# Altium schematic sheet cb_v0.SchDoc
size A4; PageSetup: Record=PageOptions|CenterHorizontal=True|CenterVertical=True|PrintScale=0.98|XCorrection=1.00|YCorrection=1.00|PrintKind=1|BorderSize=5000000|LeftOffset=0|BottomOffset=0|Orientation=2|PaperLength=1000|PaperWidth=1000|Scale=100|PaperSource=7|PrintQuality=600|MediaType=1|DitherType=10|PrintScaleMode=1|PaperKind=A4|PaperIndex=9
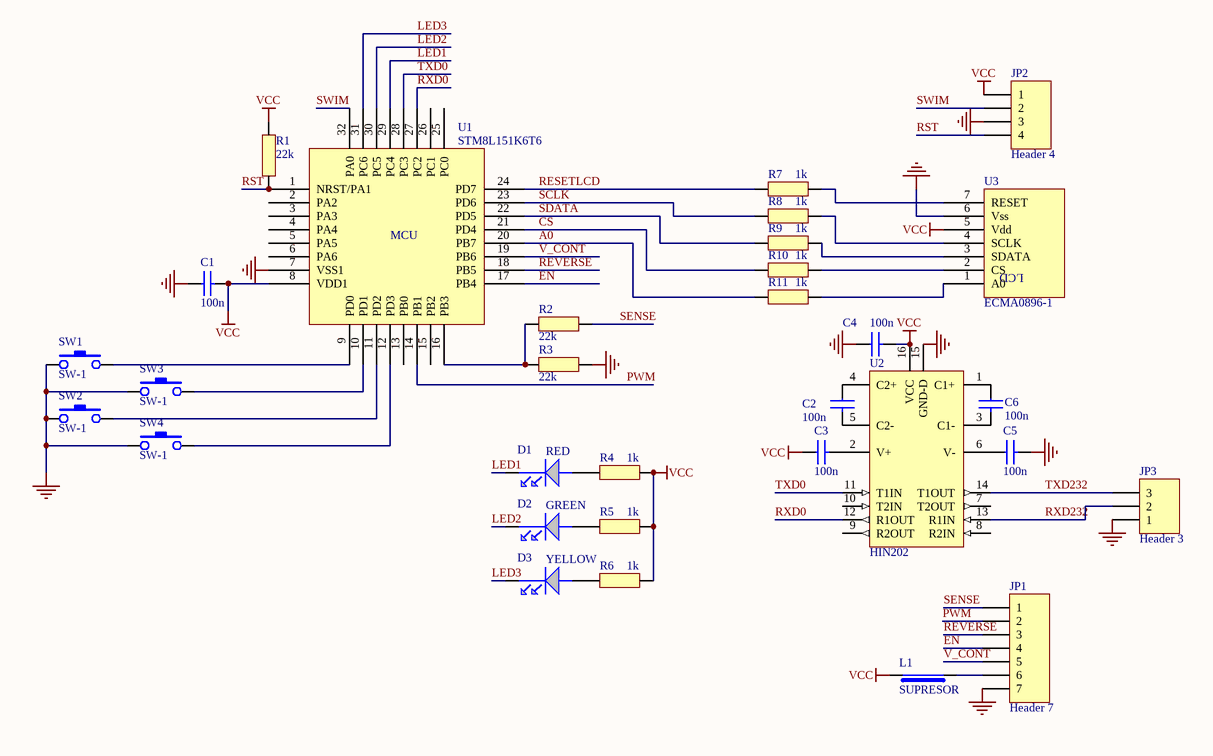
[diagram p0: cb_v0.SchDoc]

## Parts
C1  100n  [C-0805]
C2  100n  [C-0805]
C3  100n  [C-0805]
C4  100n  [C-0805]
C5  100n  [C-0805]
C6  100n  [C-0805]
D1  RED  [LED-DIP-1]
D2  GREEN  [LED-DIP-1]
D3  YELLOW  [LED-DIP-1]
JP1  Header 7  [HDR1X7]
JP2  Header 4  [HDR1X4]
JP3  Header 3  [HDR1X3]
L1  SUPRESOR  [R-1206]
R1  22k  [R-0805]
R2  22k  [R-0805]
R3  22k  [R-0805]
R4  1k  [R-0805]
R5  1k  [R-0805]
R6  1k  [R-0805]
R7  1k  [R-0805]
R8  1k  [R-0805]
R9  1k  [R-0805]
R10  1k  [R-0805]
R11  1k  [R-0805]
SW1  SW-1  [SW2mini]
SW2  SW-1  [SW2mini]
SW3  SW-1  [SW2mini]
SW4  SW-1  [SW2mini]
U1  STM8L151K6T6  [QFP32]
U2  HIN202  [SO16-(SOT-109-1)]
U3  ECMA0896-1  [ECMA0896]

## Nets
GND: C1.1 C4.1 C5.2 JP1.7 JP2.3 JP3.1 R3.2 SW1.2 SW2.2 SW3.2 SW4.2 U1.7(VSS1) U2.15(GND-D) U3.6(Vss)  [also labelled GND-D]
VCC: C1.2 C3.1 C4.2 JP2.1 L1.2 R1.1 R4.2 R5.2 R6.2 U1.8(VDD1) U2.16(VCC) U3.5(Vdd)
A0: R11.1 U1.20(PB7)
CS: R10.1 U1.21(PD4)
EN: JP1.4 U1.17(PB4)
LED1: D1.K(CATHODE) U1.29(PC4)
LED2: D2.K(CATHODE) U1.30(PC5)
LED3: D3.K(CATHODE) U1.31(PC6)
PWM: JP1.2 U1.14(PB1)
RESETLCD: R7.1 U1.24(PD7)
REVERSE: JP1.3 U1.18(PB5)
RST: JP2.4 R1.2 U1.1(NRST/PA1)
RXD0: U1.27(PC2) U2.12(R1OUT)
RXD232: JP3.2 U2.13(R1IN)
SCLK: R8.1 U1.23(PD6)
SDATA: R9.1 U1.22(PD5)
SENSE: JP1.1 R2.1
SWIM: JP2.2 U1.32(PA0)
TXD0: U1.28(PC3) U2.11(T1IN)
TXD232: JP3.3 U2.14(T1OUT)
V_CONT: JP1.5 U1.19(PB6)
NetC2_1: C2.1 U2.4(C2+)
NetC2_2: C2.2 U2.5(C2-)
NetC3_2: C3.2 U2.2(V+)
NetC5_1: C5.1 U2.6(V-)
NetC6_1: C6.1 U2.1(C1+)
NetC6_2: C6.2 U2.3(C1-)
NetD1_A: D1.A(ANODE) R4.1
NetD2_A: D2.A(ANODE) R5.1
NetD3_A: D3.A(ANODE) R6.1
NetJP1_6: JP1.6 L1.1
NetR2_2: R2.2 R3.1 U1.16(PB3)
NetR7_2: R7.2 U3.7(RESET)
NetR8_2: R8.2 U3.4(SCLK)
NetR9_2: R9.2 U3.3(SDATA)
NetR10_2: R10.2 U3.2(CS)
NetR11_2: R11.2 U3.1(A0)
NetSW1_1: SW1.1 U1.9(PD0)
NetSW2_1: SW2.1 U1.11(PD2)
NetSW3_1: SW3.1 U1.10(PD1)
NetSW4_1: SW4.1 U1.12(PD3)

Not connected (* = marked no-connect by the designer): U1 2(PA2) 3(PA3) 4(PA4) 5(PA5) 6(PA6) 13(PB0) 15(PB2) 25(PC0) 26(PC1); U2 7(T2OUT) 8(R2IN) 9(R2OUT) 10(T2IN)

## Notes on the sheet
- (in symbol ECMA0896) LCD
- (in symbol STM32L151) MCU

## Library data of the parts
C1-C6 = C: Производитель: *; Точность: *; Напряжение: *; Тип диэлектрика: *
D1-D3 = LED
JP1 = Header 7: Header, 7-Pin; LatestRevisionDate: 17-Jul-2002; LatestRevisionNote: Re-released for DXP Platform.; Publisher: Altium Limited
JP2 = Header 4: Header, 4-Pin; LatestRevisionDate: 17-Jul-2002; LatestRevisionNote: Re-released for DXP Platform.; Publisher: Altium Limited
JP3 = Header 3: Header, 3-Pin; LatestRevisionDate: 17-Jul-2002; LatestRevisionNote: Re-released for DXP Platform.; Publisher: Altium Limited
R1-R11 = R: Производитель: *; Точность: *; Тип: *
U1 = STM32L151
U2 = HIN202: RS232 driver; Производитель: *; Допустимая замена: *; Цена: *; PDF файл: *; Температурный диапазон: *
U3 = ECMA0896
L1 = SUPRESOR: Примечание: *; Производитель: *
SW1-SW4 = SW-1: Производитель: *; Допустимая замена: *; Цена: *; PDF файл: *; Температурный диапазон: *; Описание пользователя: *; *: *